# EAGLE schematic untitled (EAGLE 9.6.2)
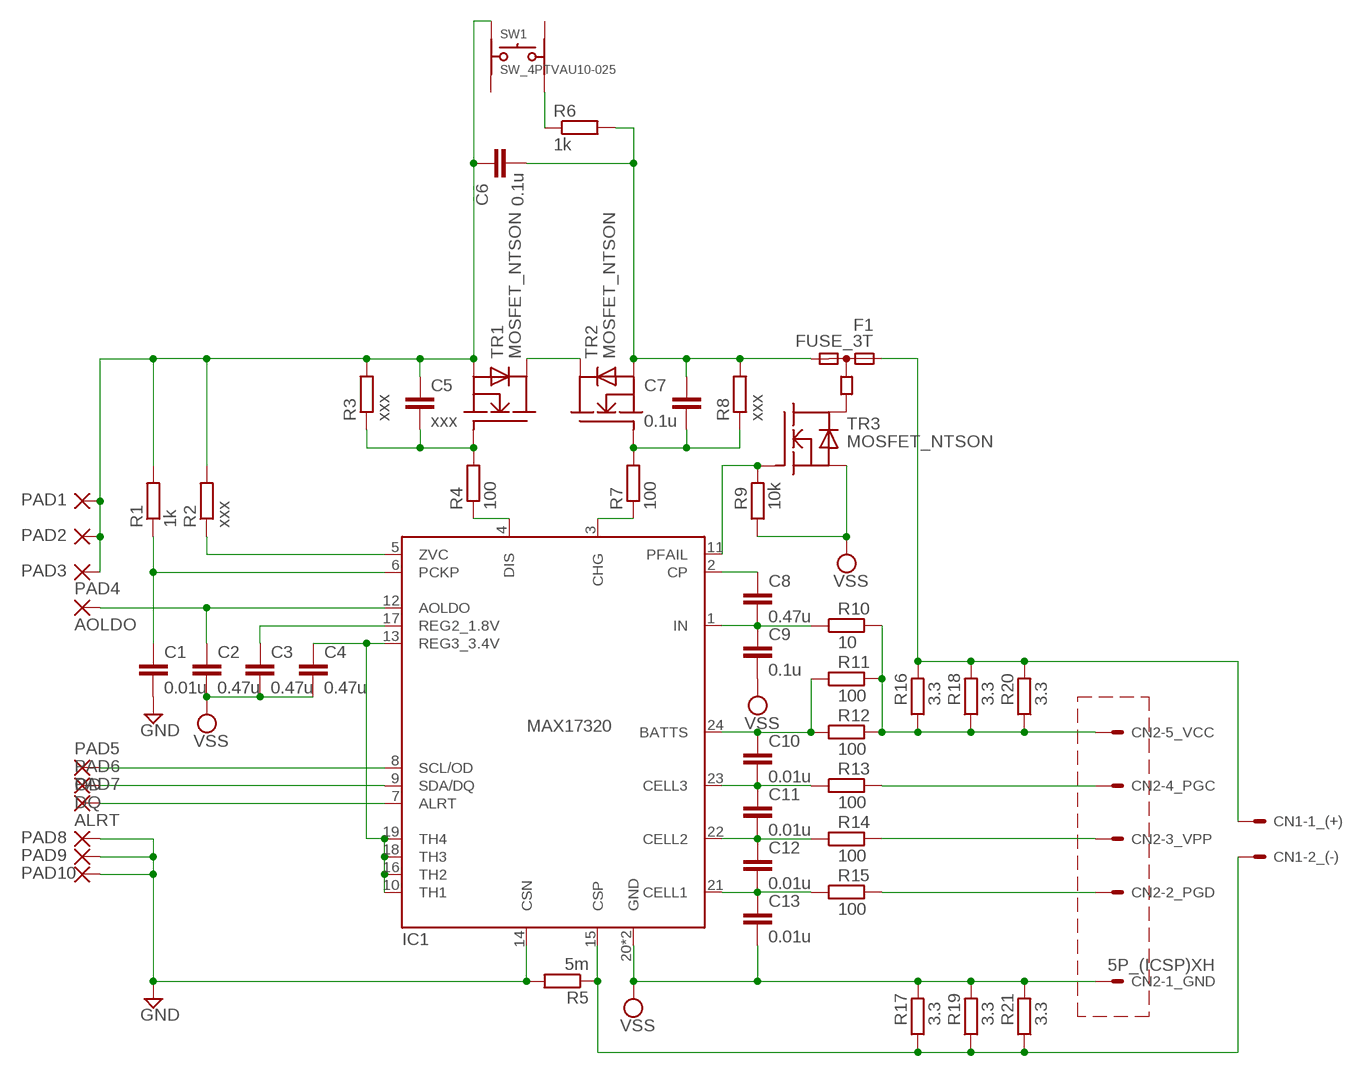
[diagram p0: schematic, sheet 1]

## Parts
C1  0.01u  C-EUC0402  [C0402]
C2  0.47u  C-EUC0402  [C0402]
C3  0.47u  C-EUC0402  [C0402]
C4  0.47u  C-EUC0402  [C0402]
C5  xxx  C-EUC0402  [C0402]
C6  0.1u  C-EUC0402  [C0402]
C7  0.1u  C-EUC0402  [C0402]
C8  0.47u  C-EUC0402  [C0402]
C9  0.1u  C-EUC0402  [C0402]
C10  0.01u  C-EUC0402  [C0402]
C11  0.01u  C-EUC0402  [C0402]
C12  0.01u  C-EUC0402  [C0402]
C13  0.01u  C-EUC0402  [C0402]
CN1  2P_(POWER)VH  [VH-2]
CN2  5P_(ICSP)XH  [XH-5]
F1  FUSE_3T  [FUSE_ITV4030]
IC1  MAX17320  [TQFN24-EP]
PAD1  WIREPAD2.0/1.2  [2.0/1.3]
PAD2  WIREPAD2.0/1.2  [2.0/1.3]
PAD3  WIREPAD2.0/1.2  [2.0/1.3]
PAD4  AOLDO  WIREPAD2.0/1.2  [2.0/1.3]
PAD5  OD  WIREPAD2.0/1.2  [2.0/1.3]
PAD6  DQ  WIREPAD2.0/1.2  [2.0/1.3]
PAD7  ALRT  WIREPAD2.0/1.2  [2.0/1.3]
PAD8  WIREPAD2.0/1.2  [2.0/1.3]
PAD9  WIREPAD2.0/1.2  [2.0/1.3]
PAD10  WIREPAD2.0/1.2  [2.0/1.3]
R1  1k  R-EU_R0402  [R0402]
R2  xxx  R-EU_R0402  [R0402]
R3  xxx  R-EU_R0402  [R0402]
R4  100  R-EU_R0402  [R0402]
R5  5m  R-EU_R1210  [R1210]
R6  1k  R-EU_R0402  [R0402]
R7  100  R-EU_R0402  [R0402]
R8  xxx  R-EU_R0402  [R0402]
R9  10k  R-EU_R0402  [R0402]
R10  10  R-EU_R0402  [R0402]
R11  100  R-EU_R0402  [R0402]
R12  100  R-EU_R0402  [R0402]
R13  100  R-EU_R0402  [R0402]
R14  100  R-EU_R0402  [R0402]
R15  100  R-EU_R0402  [R0402]
R16  3.3  R-EU_R0402  [R0402]
R17  3.3  R-EU_R0402  [R0402]
R18  3.3  R-EU_R0402  [R0402]
R19  3.3  R-EU_R0402  [R0402]
R20  3.3  R-EU_R0402  [R0402]
R21  3.3  R-EU_R0402  [R0402]
SW1  SW_4PTVAU10-025  [TVAU10-025]
TR1  MOSFET_NTSON  [TSON_ADVANCE]
TR2  MOSFET_NTSON  [TSON_ADVANCE]
TR3  MOSFET_NTSON  [TSON_ADVANCE]

## Nets
GND: C1.2 IC1.14(CSN) PAD8.1(P) PAD9.1(P) PAD10.1(P) R5.2
N$1: CN2.4 R15.2
N$2: IC1.11(PFAIL) R9.2 TR3.4(G)
N$3: C8.1 IC1.2(CP)
N$4: CN2.3 R14.2
N$5: C6.2 C7.1 F1.F2 R6.2 R8.2 TR2.1(S) TR2.2(S) TR2.3(S)
N$6: CN2.1 R10.2 R11.2 R12.2 R16.1 R18.1 R20.1
N$7: CN2.2 R13.2
N$8: C2.1 IC1.12(AOLDO) PAD4.1(P)
N$9: IC1.3(CHG) R7.1
N$10: CN1.1 F1.F1 R16.2 R18.2 R20.2
N$11: TR1.5(D) TR1.5_(D) TR1.6(D) TR1.7(D) TR1.8(D) TR1.8_(D) TR1.EP2(D) TR1.EP(D) TR2.5(D) TR2.5_(D) TR2.6(D) TR2.7(D) TR2.8(D) TR2.8_(D) TR2.EP2(D) TR2.EP(D)
N$12: IC1.4(DIS) R4.1
N$13: C8.2 C9.1 IC1.1(IN) R10.1
N$14: C4.1 IC1.10(TH1) IC1.13(REG3_3.4V) IC1.16(TH2) IC1.18(TH3) IC1.19(TH4)
N$15: F1.H TR3.5(D) TR3.5_(D) TR3.6(D) TR3.7(D) TR3.8(D) TR3.8_(D) TR3.EP2(D) TR3.EP(D)
N$16: CN1.2 IC1.15(CSP) R5.1 R17.1 R19.1 R21.1
N$18: C3.1 IC1.17(REG2_1.8V)
N$20: IC1.5(ZVC) R2.1
N$21: C7.2 R7.2 R8.1 TR2.4(G)
N$22: C1.1 IC1.6(PCKP) R1.1
N$23: C5.2 R3.1 R4.2 TR1.4(G)
N$24: C5.1 C6.1 PAD1.1(P) PAD2.1(P) PAD3.1(P) R1.2 R2.2 R3.2 SW1.P$1(A) TR1.1(S) TR1.2(S) TR1.3(S)
N$25: IC1.8(SCL/OD) PAD5.1(P)
N$26: IC1.9(SDA/DQ) PAD6.1(P)
N$29: C10.2 C11.1 IC1.23(CELL3) R13.1
N$30: IC1.7(ALRT) PAD7.1(P)
N$32: R6.1 SW1.P$4(=B)
N$43: C11.2 C12.1 IC1.22(CELL2) R14.1
N$68: C12.2 C13.1 IC1.21(CELL1) R15.1
N$69: C10.1 IC1.24(BATTS) R11.1 R12.1
VSS: C2.2 C3.2 C4.2 C9.2 C13.2 CN2.5 IC1.20(GND) IC1.EXP(GND) R9.1 R17.2 R19.2 R21.2 TR3.1(S) TR3.2(S) TR3.3(S)
Unconnected: SW1.P$2(=A) SW1.P$3(B)

## Library data of the parts
C1-C13 = rcl:C-EU: CAPACITOR, European symbol; SPICEPREFIX: C
CN1 = 4 CONNECTOR:2P_(POWER)
CN2 = 4 CONNECTOR:5P_(ICSP)
F1 = 0 my parts:FUSE_3T
IC1 = 0 my parts:MAX17320
PAD1-PAD10 = 4 PAD:WIREPAD: Wire PAD connect wire on PCB
R1-R21 = rcl:R-EU_: RESISTOR, European symbol; SPICEPREFIX: R
SW1 = 0 my parts:SW_4P
TR1-TR3 = 0 my parts:MOSFET_N